# Altium schematic sheet PA-CONTROL.SchDoc
size A3; SheetNumber: 5; SheetTotal: 5
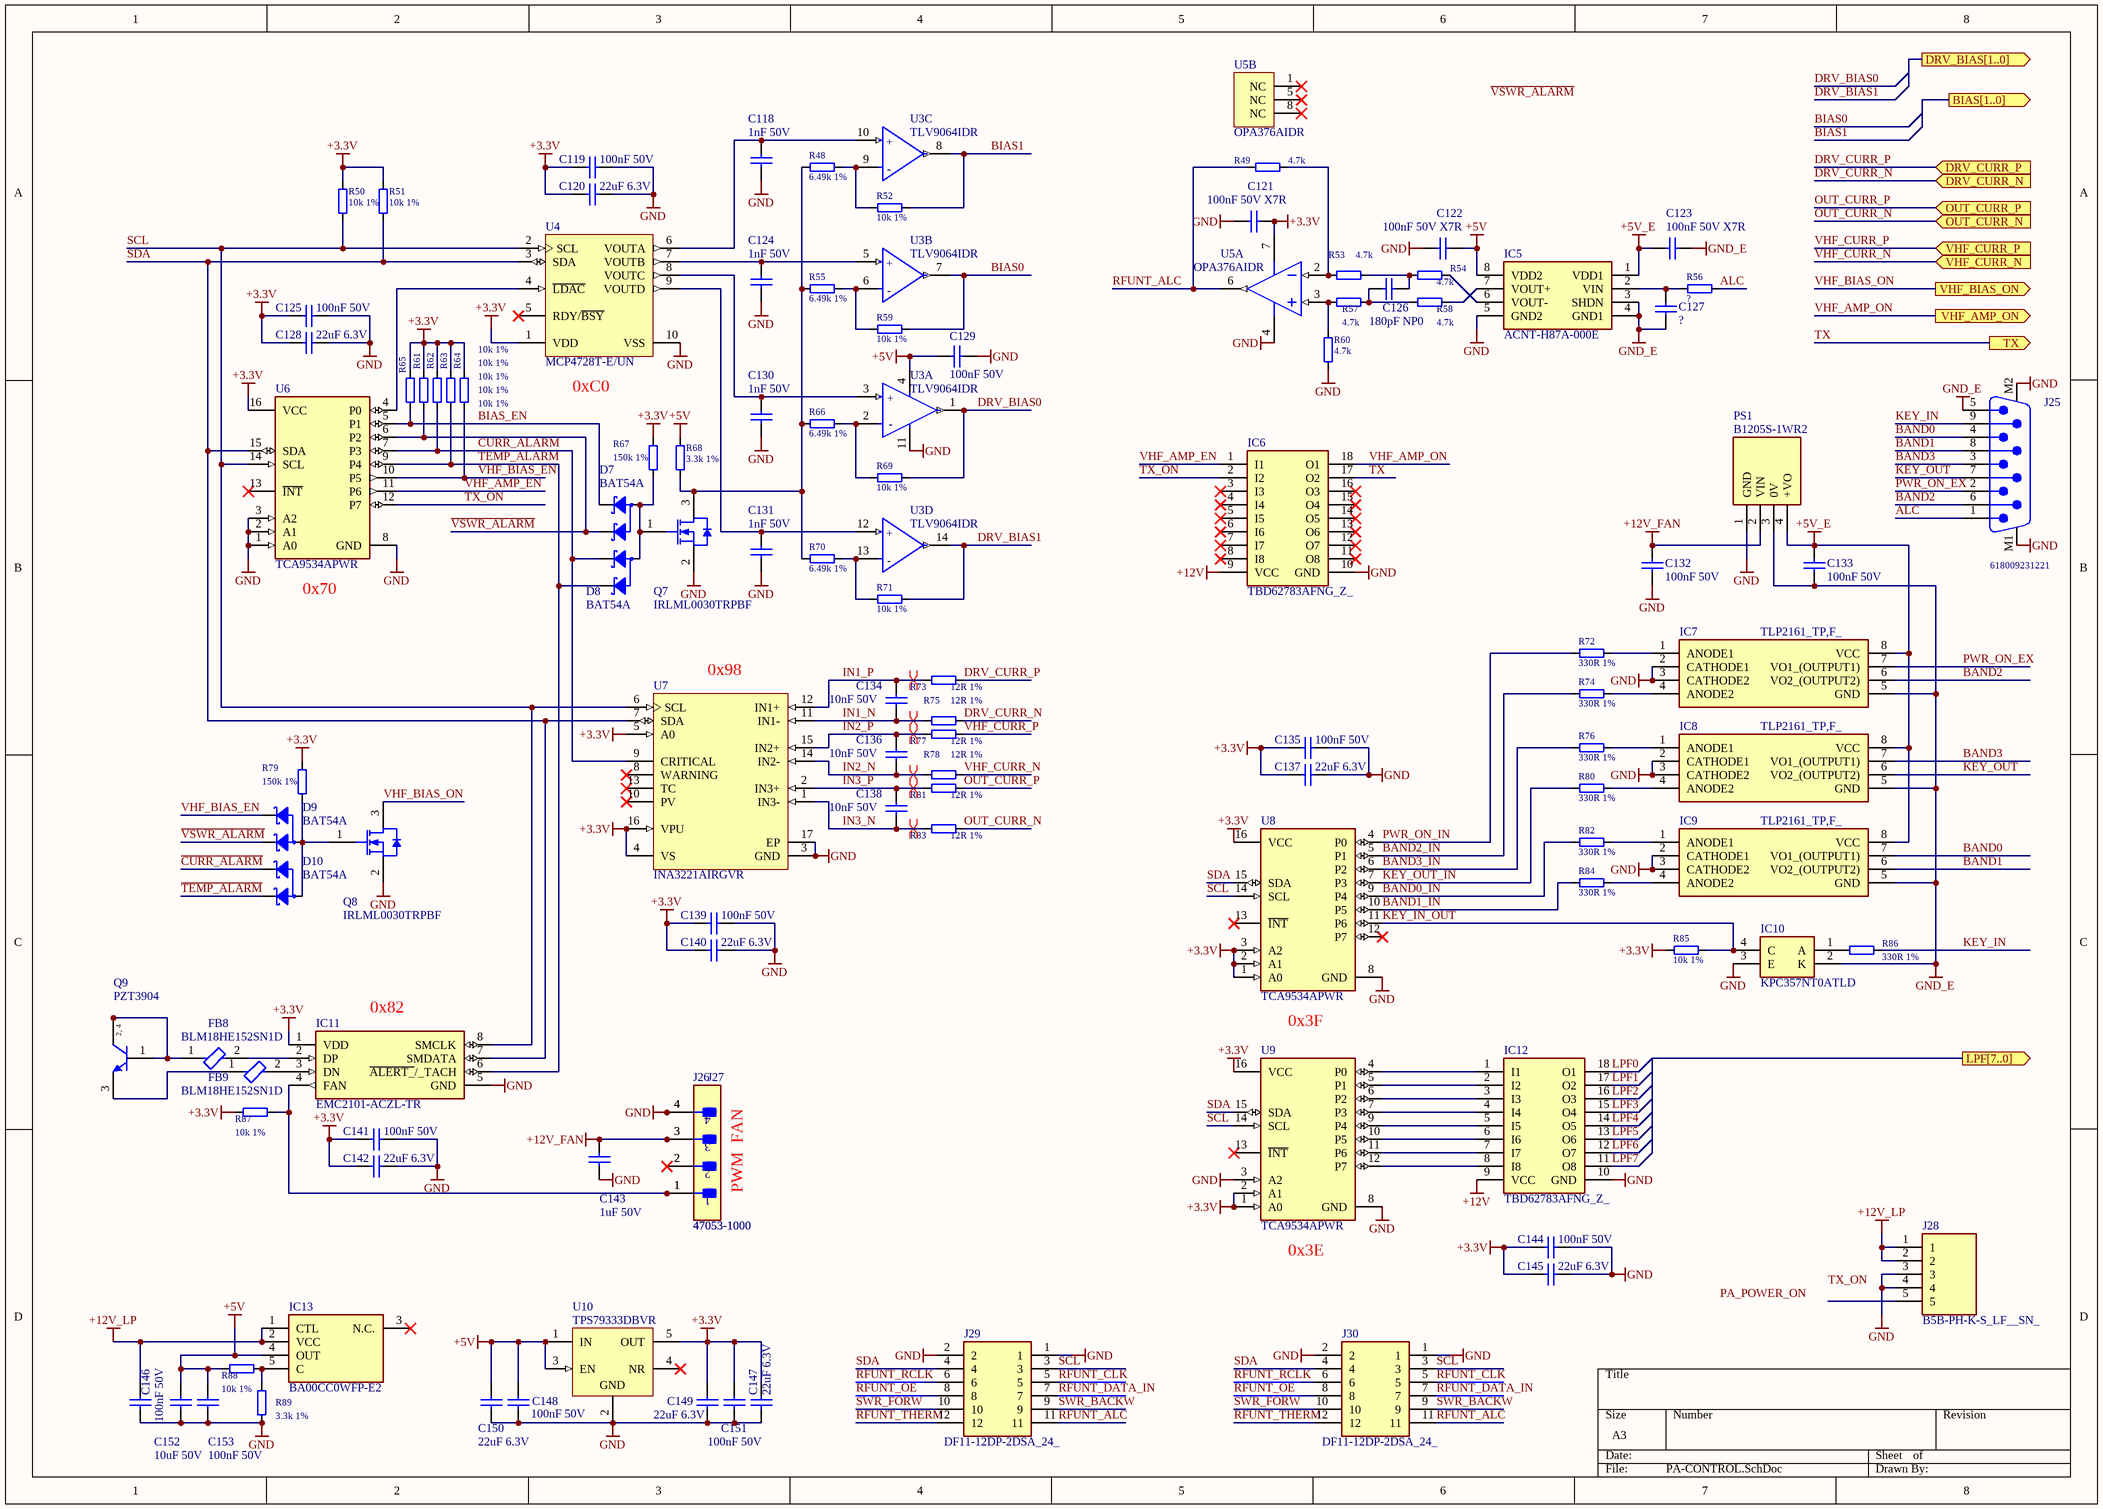
[diagram p0: PA-CONTROL.SchDoc]

## Parts
C118  1nF 50V  [C-0805]
C119  100nF 50V  [C-0805]
C120  22uF 6.3V  [C-0805]
C121  100nF 50V X7R  [C-0805]
C122  100nF 50V X7R  [C-0805]
C123  100nF 50V X7R  [C-0805]
C124  1nF 50V  [C-0805]
C125  100nF 50V  [C-0805]
C126  180pF NP0  [C-0805]
C127  ?  [C-0805]
C128  22uF 6.3V  [C-0805]
C129  100nF 50V  [C-0805]
C130  1nF 50V  [C-0805]
C131  1nF 50V  [C-0805]
C132  100nF 50V  [C-0805]
C133  100nF 50V  [C-0805]
C134  10nF 50V  [C-0805]
C135  100nF 50V  [C-0805]
C136  10nF 50V  [C-0805]
C137  22uF 6.3V  [C-0805]
C138  10nF 50V  [C-0805]
C139  100nF 50V  [C-0805]
C140  22uF 6.3V  [C-0805]
C141  100nF 50V  [C-0805]
C142  22uF 6.3V  [C-0805]
C143  1uF 50V  [C-0805]
C144  100nF 50V  [C-0805]
C145  22uF 6.3V  [C-0805]
C146  100nF 50V  [C-0805]
C147  22uF 6.3V  [C-0805]
C148  100nF 50V  [C-0805]
C149  22uF 6.3V  [C-0805]
C150  22uF 6.3V  [C-0805]
C151  100nF 50V  [C-0805]
C152  10uF 50V  [C-0805]
C153  100nF 50V  [C-0805]
D7  BAT54A  [SOT-23]
D8  BAT54A  [SOT-23]
D9  BAT54A  [SOT-23]
D10  BAT54A  [SOT-23]
FB8  BLM18HE152SN1D  [FP-BLM18-0_15-t0_8-IPC_C]
FB9  BLM18HE152SN1D  [FP-BLM18-0_15-t0_8-IPC_C]
IC5  ACNT-H87A-000E  [SOIC127P1661X403-8N]
IC6  TBD62783AFNG_Z_  [SOP65P640X155-18N]
IC7  TLP2161_TP,F_  [SOIC127P600X290-8N]
IC8  TLP2161_TP,F_  [SOIC127P600X290-8N]
IC9  TLP2161_TP,F_  [SOIC127P600X290-8N]
IC10  KPC357NT0ATLD  [KPC357NT0ATLD]
IC11  EMC2101-ACZL-TR  [SOP65P490X110-8N]
IC12  TBD62783AFNG_Z_  [SOP65P640X155-18N]
IC13  BA00CC0WFP-E2  [BA00CC0WFPE2]
J25  618009231221  [618009231221]
J26  47053-1000  [FP-47053-1000-MFG]
J27  47053-1000  [FP-47053-1000-MFG]
J28  B5B-PH-K-S_LF__SN_  [SHDR5W50P0X200_1X5_1190X450X600P]
J29  DF11-12DP-2DSA_24_  [SHDR12W60P200_2X6_1400X500X690P]
J30  DF11-12DP-2DSA_24_  [SHDR12W60P200_2X6_1400X500X690P]
PS1  B1205S-1WR2  [B1205S1WR2]
Q7  IRLML0030TRPBF  [INTR-SOT-23-3_V]
Q8  IRLML0030TRPBF  [INTR-SOT-23-3_V]
Q9  PZT3904  [FAIR-SOT223-4_V]
R48  6.49k 1%  [R-0805]
R49  4.7k  [R-0805]
R50  10k 1%  [R-0805]
R51  10k 1%  [R-0805]
R52  10k 1%  [R-0805]
R53  4.7k  [R-0805]
R54  4.7k  [R-0805]
R55  6.49k 1%  [R-0805]
R56  ?  [R-0805]
R57  4.7k  [R-0805]
R58  4.7k  [R-0805]
R59  10k 1%  [R-0805]
R60  4.7k  [R-0805]
R61  10k 1%  [R-0805]
R62  10k 1%  [R-0805]
R63  10k 1%  [R-0805]
R64  10k 1%  [R-0805]
R65  10k 1%  [R-0805]
R66  6.49k 1%  [R-0805]
R67  150k 1%  [R-0805]
R68  3.3k 1%  [R-0805]
R69  10k 1%  [R-0805]
R70  6.49k 1%  [R-0805]
R71  10k 1%  [R-0805]
R72  330R 1%  [R-0805]
R73  12R 1%  [R-0805]
R74  330R 1%  [R-0805]
R75  12R 1%  [R-0805]
R76  330R 1%  [R-0805]
R77  12R 1%  [R-0805]
R78  12R 1%  [R-0805]
R79  150k 1%  [R-0805]
R80  330R 1%  [R-0805]
R81  12R 1%  [R-0805]
R82  330R 1%  [R-0805]
R83  12R 1%  [R-0805]
R84  330R 1%  [R-0805]
R85  10k 1%  [R-0805]
R86  330R 1%  [R-0805]
R87  10k 1%  [R-0805]
R88  10k 1%  [R-0805]
R89  3.3k 1%  [R-0805]
U3  TLV9064IDR  [FP-D0014A-MFG]  (parts A,B,C,D of 4)
U4  MCP4728T-E/UN  [MSOP-UN10_L]
U5  OPA376AIDR  [D0008A_N]  (parts A,B of 2)
U6  TCA9534APWR  [FP-PW0016A-MFG]
U7  INA3221AIRGVR  [RGV0016A_V]
U8  TCA9534APWR  [FP-PW0016A-MFG]
U9  TCA9534APWR  [FP-PW0016A-MFG]
U10  TPS79333DBVR  [DBV0005A_L]

## Ports
BIAS[1..0] (out), DRV_BIAS[1..0] (out), DRV_CURR_N (in), DRV_CURR_P (in), LPF[7..0] (out), OUT_CURR_N (in), OUT_CURR_P (in), TX (out), VHF_AMP_ON (out), VHF_BIAS_ON (out), VHF_CURR_N (in), VHF_CURR_P (in)

## Nets
+3.3V: C119.2 C120.2 C121.2 C125.2 C128.2 C135.2 C137.2 C139.2 C140.2 C141.2 C142.2 C144.2 C145.2 C147.2 C149.2 C151.2 IC11.1(VDD) R50.1 R51.1 R61.1 R62.1 R63.1 R64.1 R65.1 R67.1 R79.1 R85.2 R87.2 U4.1(VDD) U5.7(V+) U6.16(VCC) U7.4(VS) U7.5(A0) U7.16(VPU) U8.1(A0) U8.2(A1) U8.3(A2) U8.16(VCC) U9.1(A0) U9.2(A1) U9.16(VCC) U10.5(OUT)
+5V: C122.2 C129.2 C148.2 C150.2 C152.2 C153.2 IC5.8(VDD2) IC13.4(OUT) R68.1 R88.2 U3.4(V+) U10.1(IN) U10.3(EN)
+5V_E: C123.1 C133.1 IC5.1(VDD1) IC7.8(VCC) IC8.8(VCC) IC9.8(VCC) PS1.4(+VO)
+12V: IC6.9(VCC) IC12.9(VCC)
+12V_FAN: C132.1 C143.2 J26.3 J27.3 PS1.2(VIN)
+12V_LP: C146.2 IC13.1(CTL) IC13.2(VCC) J28.1 J28.2
GND: C118.1 C119.1 C120.1 C121.1 C122.1 C124.1 C125.1 C128.1 C129.1 C130.1 C131.1 C132.2 C135.1 C137.1 C139.1 C140.1 C141.1 C142.1 C143.1 C144.1 C145.1 C146.1 C147.1 C148.1 C149.1 C150.1 C151.1 C152.1 C153.1 IC5.5(GND2) IC6.10(GND) IC7.2(CATHODE1) IC7.3(CATHODE2) IC8.2(CATHODE1) IC8.3(CATHODE2) IC9.2(CATHODE1) IC9.3(CATHODE2) IC10.3(E) IC11.5(GND) IC12.10(GND) J25.M1 J25.M2 J26.4 J27.4 J28.3 J28.4 J29.1 J29.2 J30.1 J30.2 PS1.1(GND) Q7.2(S) Q8.2(S) R60.2 R89.2 U3.11(V-) U4.10(VSS) U5.4(V-) U6.1(A0) U6.2(A1) U6.3(A2) U6.8(GND) U7.3(GND) U7.17(EP) U8.8(GND) U9.3(A2) U9.8(GND) U10.2(GND)
GND_E: C123.2 C127.2 C133.2 IC5.3(SHDN) IC5.4(GND1) IC7.5(GND) IC8.5(GND) IC9.5(GND) IC10.2(K) J25.5 PS1.3(0V)
ALC: J25.1 R56.1
BAND0: IC9.7(VO1_(OUTPUT1)) J25.4
BAND0_IN: R82.2 U8.9(P4)
BAND1: IC9.6(VO2_(OUTPUT2)) J25.8
BAND1_IN: R84.2 U8.10(P5)
BAND2: IC7.6(VO2_(OUTPUT2)) J25.6
BAND2_IN: R74.2 U8.5(P1)
BAND3: IC8.7(VO1_(OUTPUT1)) J25.3
BAND3_IN: R76.2 U8.6(P2)
BIAS0: R59.1 U3.7(OUT2)
BIAS1: R52.1 U3.8(OUT3)
BIAS_EN: D7.1 R65.2 U6.5(P1)
~{CURR_ALARM}: D8.1 D10.2 R62.2 U6.7(P3) U7.9(CRITICAL)
DRV_BIAS0: R69.1 U3.1(OUT1)
DRV_BIAS1: R71.1 U3.14(OUT4)
DRV_CURR_N: R75.1 ; port DRV_CURR_N
DRV_CURR_P: R73.1 ; port DRV_CURR_P
IN1_N: C134.1 R75.2 U7.11(IN1-)
IN1_P: C134.2 R73.2 U7.12(IN1+)
IN2_N: C136.1 R78.2 U7.14(IN2-)
IN2_P: C136.2 R77.2 U7.15(IN2+)
IN3_N: C138.1 R83.2 U7.1(IN3-)
IN3_P: C138.2 R81.2 U7.2(IN3+)
KEY_IN: J25.9 R86.1
KEY_IN_OUT: IC10.4(C) R85.1 U8.11(P6)
KEY_OUT: IC8.6(VO2_(OUTPUT2)) J25.7
KEY_OUT_IN: R80.2 U8.7(P3)
LPF0: IC12.18(O1)
LPF1: IC12.17(O2)
LPF2: IC12.16(O3)
LPF3: IC12.15(O4)
LPF4: IC12.14(O5)
LPF5: IC12.13(O6)
LPF6: IC12.12(O7)
LPF7: IC12.11(O8)
OUT_CURR_N: R83.1 ; port OUT_CURR_N
OUT_CURR_P: R81.1 ; port OUT_CURR_P
PWR_ON_EX: IC7.7(VO1_(OUTPUT1)) J25.2
PWR_ON_IN: R72.2 U8.4(P0)
RFUNT_ALC: J29.11 J30.11 R49.2 U5.6(OUT)
RFUNT_CLK: J29.5 J30.5
RFUNT_DATA_IN: J29.7 J30.7
RFUNT_OE: J29.8 J30.8
RFUNT_RCLK: J29.6 J30.6
RFUNT_THERM: J29.12 J30.12
SCL: IC11.8(SMCLK) J29.3 J30.3 R50.2 U4.2(SCL) U6.14(SCL) U7.6(SCL) U8.14(SCL) U9.14(SCL)
SDA: IC11.7(SMDATA) J29.4 J30.4 R51.2 U4.3(SDA) U6.15(SDA) U7.7(SDA) U8.15(SDA) U9.15(SDA)
SWR_BACKW: J29.9 J30.9
SWR_FORW: J29.10 J30.10
~{TEMP_ALARM}: D8.2 D10.1 IC11.6(~{ALERT_}/_TACH) R63.2 U6.9(P4)
TX: IC6.17(O2) ; port TX
TX_ON: IC6.2(I2) U6.12(P7)
~{VSWR_ALARM}: D7.2 D9.1 R61.2 U6.6(P2)
VHF_AMP_EN: IC6.1(I1) U6.11(P6)
VHF_AMP_ON: IC6.18(O1) ; port VHF_AMP_ON
VHF_BIAS_EN: D9.2 R64.2 U6.10(P5)
VHF_BIAS_ON: Q8.3(D) ; port VHF_BIAS_ON
VHF_CURR_N: R78.1 ; port VHF_CURR_N
VHF_CURR_P: R77.1 ; port VHF_CURR_P
NetC118_2: C118.2 U3.10(IN3+) U4.6(VOUTA)
NetC124_2: C124.2 U3.5(IN2+) U4.7(VOUTB)
NetC126_1: C126.1 R57.1 R58.2
NetC126_2: C126.2 R53.1 R54.2
NetC127_1: C127.1 IC5.2(VIN) R56.2
NetC130_2: C130.2 U3.3(IN1+) U4.8(VOUTC)
NetC131_2: C131.2 U3.12(IN4+) U4.9(VOUTD)
NetD7_3: D7.3 D8.3 Q7.1(G) R67.2
NetD9_3: D9.3 D10.3 Q8.1(G) R79.2
NetFB8_1: FB8.1 Q9.1(B) Q9.2(C) Q9.4(C)
NetFB8_2: FB8.2 IC11.2(DP)
NetFB9_1: FB9.1 Q9.3(E)
NetFB9_2: FB9.2 IC11.3(DN)
NetIC5_6: IC5.6(VOUT-) R54.1
NetIC5_7: IC5.7(VOUT+) R58.1
NetIC7_1: IC7.1(ANODE1) R72.1
NetIC7_4: IC7.4(ANODE2) R74.1
NetIC8_1: IC8.1(ANODE1) R76.1
NetIC8_4: IC8.4(ANODE2) R80.1
NetIC9_1: IC9.1(ANODE1) R82.1
NetIC9_4: IC9.4(ANODE2) R84.1
NetIC10_1: IC10.1(A) R86.2
NetIC11_4: IC11.4(FAN) J26.1 J27.1 R87.1
NetIC12_1: IC12.1(I1) U9.4(P0)
NetIC12_2: IC12.2(I2) U9.5(P1)
NetIC12_3: IC12.3(I3) U9.6(P2)
NetIC12_4: IC12.4(I4) U9.7(P3)
NetIC12_5: IC12.5(I5) U9.9(P4)
NetIC12_6: IC12.6(I6) U9.10(P5)
NetIC12_7: IC12.7(I7) U9.11(P6)
NetIC12_8: IC12.8(I8) U9.12(P7)
NetIC13_5: IC13.5(C) R88.1 R89.1
NetJ26_2: J26.2 J27.2
NetQ7_3: Q7.3(D) R48.2 R55.2 R66.2 R68.2 R70.2
NetR48_1: R48.1 R52.2 U3.9(IN3-)
NetR49_1: R49.1 R53.2 U5.2(IN-)
NetR55_1: R55.1 R59.2 U3.6(IN2-)
NetR57_2: R57.2 R60.1 U5.3(IN+)
NetR66_1: R66.1 R69.2 U3.2(IN1-)
NetR70_1: R70.1 R71.2 U3.13(IN4-)
NetU4_4: U4.4(~{LDAC}) U6.4(P0)

Not connected (* = marked no-connect by the designer): IC6 3(I3)* 4(I4)* 5(I5)* 6(I6)* 7(I7)* 8(I8)* 11(O8)* 12(O7)* 13(O6)* 14(O5)* 15(O4)* 16(O3)*; IC13 3(N.C.)*; J28 5; U4 5(RDY/~{BSY})*; U5 1(NC)* 5(NC)* 8(NC)*; U6 13(~{INT})*; U7 8(WARNING)* 10(PV)* 13(TC)*; U8 12(P7)* 13(~{INT})*; U9 13(~{INT})*; U10 4(NR)*

## Layout directives
differential pair: IN1_N, IN1_P, IN2_N, IN2_P, IN3_N, IN3_P

## Notes on the sheet
- (near U4) 0xC0
- (near U6) 0x70
- (near U7) 0x98
- (near IC11) 0x82
- 0x3F
- PWM  FAN
- (near U9) 0x3E
- Labels drawn without touching a wire or pin: PA_POWER_ON, TX_ON, ~{VSWR_ALARM}
- (in symbol CMP-2000-06916-1) 2, 4
- (in symbol CMP-04895-000189-1, part A) +; -
- (in symbol CMP-04895-000189-1, part B) +; -
- (in symbol CMP-04895-000189-1, part C) +; -
- (in symbol CMP-04895-000189-1, part D) +; -

## Library data of the parts
C118-C153 = C semi: Ceramic Multilayer Capacitor
FB8 FB9 = CMP-0686-00368-3: Chip Ferrite Bead, 0603, 1500Ω @ 100MHz, 0.5Ω, 25%, 500mA; Impedance: 1.5kR; DC Resistance (DCR): 500mR; Number of Circuits: 1; Test Frequency: 100MHz; Case/Package: 0603; Max Operating Temperature: 125°C; Package Quantity: 1; Max DC Current: 500mA; Tolerance: 25%; Core Material: Ferrite; Width: 0.8mm; Number of Pins: 2; Depth: 0.8mm; Radiation Hardening: No; Case Code (Imperial): 0603; Min Operating Temperature: -55°C; Termination: SMD/SMT; Material: Ferrite; Military Standard: Not; Number of Lines: 1; DC Current: 500mA; Length: 1.6mm; REACH SVHC: No SVHC; Lead Free: Lead Free; Current Rating: 500mA; Max Current Rating: 500mA; Packaging: Tape and Reel; Case Code (Metric): 1608; Height: 0.8mm
IC5 = ACNT-H87A-000E: Integrated Circuit; Manufacturer_Name: Avago Technologies; Datasheet Link: https://4donline.ihs.com/images/VipMasterIC/IC/AVGO/AVGO-S-A0003550281/AVGO-S-A0003550281-1.pdf?hkey=52A5661711E402568146F3353EA87419; Height: 4.034mm; Manufacturer_Part_Number: ACNT-H87A-000E; Mouser Part Number: 630-ACNT-H87A-000E; Mouser Price/Stock: https://www.mouser.co.uk/ProductDetail/Broadcom-Avago/ACNT-H87A-000E?qs=BZBei1rCqCBJ1okFPm4nfQ%3D%3D
IC6 IC12 = TBD62783AFNG_Z_: Integrated Circuit; Manufacturer_Name: Toshiba; Manufacturer_Part_Number: TBD62783AFNG(Z); Datasheet Link: https://toshiba.semicon-storage.com/info/docget.jsp?did=30523; Height: 1.55mm
IC7-IC9 = TLP2160_TP,F_: Integrated Circuit; Manufacturer_Name: Toshiba; Manufacturer_Part_Number: TLP2160(TP,F); Datasheet Link: https://toshiba.semicon-storage.com/info/docget.jsp?did=10044&prodName=TLP2160; Height: 2.9mm; Mouser Part Number: 757-TLP2160TPF; Mouser Price/Stock: https://www.mouser.co.uk/ProductDetail/Toshiba/TLP2160TPF?qs=BybUIy1AcUYH5UC919f%2FeA%3D%3D; Arrow Part Number: TLP2160(TP,F); Arrow Price/Stock: https://www.arrow.com/en/products/tlp2160-tpf/toshiba
IC10 = KPC357NT0ATLD: Integrated Circuit; Manufacturer_Name: Cosmo Electronics; Datasheet Link: https://datasheet.lcsc.com/szlcsc/Cosmo-Electronics-KPC357NT0ATLD_C136410.pdf; Height: 2.7mm; Manufacturer_Part_Number: KPC357NT0ATLD
IC11 = EMC2101-ACZL-TR: Integrated Circuit; Manufacturer_Name: Microchip; Datasheet Link: http://ww1.microchip.com/downloads/en/DeviceDoc/2101.pdf; Height: 1.1mm; Manufacturer_Part_Number: EMC2101-ACZL-TR; Mouser Part Number: 886-EMC2101-ACZL-TR; Mouser Price/Stock: https://www.mouser.co.uk/ProductDetail/Microchip-Technology/EMC2101-ACZL-TR?qs=pA5MXup5wxFIE%2FN8LSbs9g%3D%3D; Arrow Part Number: EMC2101-ACZL-TR; Arrow Price/Stock: https://www.arrow.com/en/products/emc2101-aczl-tr/microchip-technology
IC13 = BA00CC0WFP-E2: Integrated Circuit; Manufacturer_Name: ROHM Semiconductor; Datasheet Link: https://datasheet.datasheetarchive.com/originals/dk/DKDS-10/186347.pdf; Height: 2.5mm; Manufacturer_Part_Number: BA00CC0WFP-E2; Mouser Part Number: 755-BA00CC0WFP-E2; Mouser Price/Stock: https://www.mouser.co.uk/ProductDetail/ROHM-Semiconductor/BA00CC0WFP-E2?qs=4kLU8WoGk0t%2Fg3HZY45H1w%3D%3D; Arrow Part Number: BA00CC0WFP-E2; Arrow Price/Stock: https://www.arrow.com/en/products/ba00cc0wfp-e2/rohm-semiconductor
J25 = CMP-1502-00284-1: Male PCB Connector with Hex Screw WR-DSUB, 8.08 mm, Angled, 9 pins; Manufacturer: Wurth Elektronik; Working Voltage: 125VAC; Contact Resistance: 30mOhm; Rated Current: 3A; Pin Number: 9; Manufacturer URL: http://www.we-online.de; Orientation: Angled; Operating Temperature: -40to85degC; Package Reference: 618009231221; Gender: Male; Mounting Technology: THT; Publisher: WurthElektronik; Datasheet URL: https://katalog.we-online.de/em/datasheet/6180xx231221.pdf; Part Number: 618009231221; Packaging: Tray
J26 J27 = CMP-04776-000290-1: CONN HEADER VERT 4POS 2.54MM; Number of Positions: 4; Voltage Rating (DC): 250V; Gender: Male; Current Rating: 4A; Glow Wire Compliant: Non-compliant; Contact Material: Brass; Contact Plating: Tin; Radiation Hardening: No; Package Quantity: 12000; Packaging: Bulk; Termination: Through Hole; Depth: 5.84mm; Series: 47053; Number of Contacts: 4; Length: 10.2mm; Halogen Free: Low Halogen; Number of Circuits: 4; Max Operating Temperature: 75°C; Housing Color: Beige; Min Operating Temperature: 0°C; Number of Rows: 1; Pitch: 2.54mm; Housing Material: Nylon; Orientation: Vertical; Mount: Through Hole; Voltage Rating: 250V
J28 = B5B-PH-K-S_LF__SN_: Connector; Manufacturer_Name: JST (JAPAN SOLDERLESS TERMINALS); Manufacturer_Part_Number: B5B-PH-K-S(LF)(SN); Datasheet Link: http://uk.rs-online.com/web/p/products/8201438; Height: 6mm; Arrow Part Number: B5B-PH-K-S(LF)(SN); Arrow Price/Stock: https://www.arrow.com/en/products/b5b-ph-k-s-lf-sn/jst-manufacturing
J29 J30 = DF11-12DP-2DSA_24_: Connector; Manufacturer_Name: Hirose; Manufacturer_Part_Number: DF11-12DP-2DSA(24); Datasheet Link: https://datasheet.datasheetarchive.com/originals/distributors/SFDatasheet-7/sf-000141225.pdf; Height: 6.9mm; Mouser Part Number: 798-DF11-12DP-2DSA24; Mouser Price/Stock: https://www.mouser.co.uk/ProductDetail/Hirose-Connector/DF11-12DP-2DSA24?qs=zOgoZG1CgI9hGIQfeQgy6Q%3D%3D; Arrow Part Number: DF11-12DP-2DSA(24); Arrow Price/Stock: https://www.arrow.com/en/products/df11-12dp-2dsa-24/hirose-electric
PS1 = B1205S-1WR2: Power Supply; Manufacturer_Name: Mornsun; Datasheet Link: https://www.mornsun-power.com/public/uploads/pdf/B_D-1WR2.pdf; Height: 10.41mm; Manufacturer_Part_Number: B1205S-1WR2
Q7 Q8 = CMP-2000-06483-1: HEXFET(R) Power MOSFET, 1.3 W, 4.4 ns, -55 to 150 degC, 3-Pin SOT-23, RoHS, Tape and Reel; Manufacturer: International Rectifier; Maximum Drain Source Resistance: 0.027Ω; Transistor Configuration: Single; Channel Mode: Enhancement; Maximum Power Dissipation: 1.3W; Typical Input Capacitance @ Vds: 382pF@15V; Maximum Gate Source Voltage: ±20V; Number of Elements per Chip: 1; Transistor Material: Si; Maximum Gate Threshold Voltage: 2.3V; Typical Turn-On Delay Time: 5.2ns; Maximum Drain Source Voltage: 30V; Typical Turn-Off Delay Time: 7.4ns; Minimum Gate Threshold Voltage: 1.3V; Channel Type: N; Typical Gate Charge @ Vgs: 2.6nC@4.5V; Maximum Continuous Drain Current: 5.3A; Pin Count: 3; Mounting Technology: SurfaceMount; Datasheet URL: https://datasheet.ciiva.com/4442/irlml0030pbf-90019-4442451.pdf; Datasheet Version: 02/2012; Maximum Operating Temperature: +150°C; Category: PowerMOSFET; Package Description: 3-Pin Small Outline Transistor, Body 2.92 x 1.3 mm, Pitch 0.95 mm; Manufacturer URL: http://internationalrectifier.com/; Height: 1.02mm; Minimum Operating Temperature: -55°C; Dimensions: 3.04x1.4x1.02mm; Package Reference: SOT-23-3; Package Type: SOT-23; Mounting Type: SurfaceMount; Length: 3.04mm; Width: 1.4mm
Q9 = CMP-2000-06916-1: NPN General-Purpose Amplifier, 40 V, 200 mA, -55 to 150 degC, 4-Pin SOT223, RoHS, Tape and Reel; Manufacturer: FairchildSemiconductor; Maximum Collector Emitter Saturation Voltage: 0.2@1mA@10mA; Package Version: Rev. 3, 07/2016; Rad Hard: No; Minimum DC Current Gain: 40@0.1mA@1V; Maximum DC Collector Current: 0.2A; Maximum Collector Base Voltage: 60V; Maximum Operating Frequency: 300(Min)MHz; Maximum Power Dissipation: 1000mW; Maximum Collector Emitter Voltage: 40V; Manufacturer URL: https://www.fairchildsemi.com/; Package URL: https://www.fairchildsemi.com.cn/package-drawings/MA/MA04A.pdf; Mounting Technology: SurfaceMount; Mounting: SurfaceMount; Datasheet URL: https://www.fairchildsemi.com/datasheets/MM/MMBT3904.pdf; Operating Temperature: -55to150°C; Package Description: 4-Pin Small Outline Transistor, Body 6.45 x 3.5 mm, Pitch 2.3 mm; Datasheet Version: Rev. 1.1.0, 10/2014; Packaging: Tape&Reel; Package Reference: SOT223-4; Package: 4SOT-223; Category: GPBJT; Type: NPN; Pin Count: 4
R48-R89 = RES semi: Chip Resistor; Power: *; TCR: *; Series: *; Tolerance: *
U3 = CMP-04895-000189-1: IC CMOS 4 CIRCUIT 14SOIC; Output Current per Channel: 50mA; Number of Circuits: 4; Gain Bandwidth Product: 10MHz; Input Bias Current: 0.5pA; Slew Rate: 6.5V/µs; Operating Supply Current: 538uA; Input Offset Voltage (Vos): 300uV; Min Operating Temperature: -40°C; RoHS Compliant: Yes; Max Operating Temperature: 125°C; Mount: Surface Mount; Number of Pins: 14; Packaging: Cut Tape; Case/Package: SOIC; Number of Channels: 4
U4 = CMP-0188-01009-2: 12-Bit Quad Digital-to-Analog Converter with EEPROM Memory, 10-pin MSOP, Extended Temperature, Tape and Reel; ComponentLink3Description: Package Specification; ComponentLink3URL: http://www.microchip.com/stellent/groups/techpub_sg/documents/packagingspec/en012702.pdf; RevisionNote: URLs added. DatasheetVersion updated.; DatasheetVersion: revE, Oct-2010; ComponentLink2URL: http://ww1.microchip.com/downloads/en/DeviceDoc/22187E.pdf; ComponentLink2Description: Datasheet; PackageDescription: 10-Lead Plastic Micro Small Outline Package (UN) [MSOP]; PackageVersion: revBB, Aug-2009; ComponentLink1Description: Manufacturer URL; ComponentLink1URL: http://www.microchip.com/; PackageReference: MSOP-UN10
U5 = CMP-0272-00694-3: Precision, Low Noise, Low Iq Operational Amplifier, 2.2 to 5.5 V, -40 to 125 degC, 8-pin SOIC (D8), Green (RoHS & no Sb/Br); Manufacturer: Texas Instruments; Vio (25C)(Max)(mV): 0.025; Number of Channels: 1; Sub Family: Low Input Bias Current Amp (<=10pA), Low Noise Amp (<=10nV/rtHz), Low Offset Voltage Amplifier (<=500uV), Low Supply Voltage Amplifier (<=2.7V), Precision Amplifier; Offset Drift(Typ)(uV/C): 0.32; Total Supply Voltage(Max)(+5V is 5, +/-5V is 10): 5.5; Vn at 1kHz(Typ)(nV/rtHz): 7.5; IIB(Max)(pA): 10; CMRR(Min)(dB): 76; Iq per channel(Max)(mA): 0.95; Total Supply Voltage(Min)(+5V is 5, +/-5V is 10): 2.2; Slew Rate(Typ)(V/us): 2; ComponentLink3URL: http://www.ti.com/litv/pdf/msoi002j; ComponentLink3Description: Package Specification; ComponentLink1Description: Manufacturer URL; Eco-Plan: Green (RoHS & no Sb/Br); DatasheetVersion: SBOS406F; PackageVersion: 4040047-3/M, 06/2011; ComponentLink1URL: http://www.ti.com/; PackageDescription: 8-Pin Plastic Small Outline, Body 4.9 x 3.9 mm, Pitch 1.27 mm; ComponentLink2Description: Datasheet; PackageReference: D0008A; PartNumber: OPA376AIDR; Mounting Technology: Surface Mount; ComponentLink2URL: http://www.ti.com/general/docs/lit/getliterature.tsp?genericPartNumber=OPA376&fileType=pdf; Code_JEDEC: MS-012
U6 U8 U9 = CMP-04886-000001-1: IC I/O EXPANDER I2C 8B 16TSSOP; Manufacturer: Texas Instruments; Max Junction Temp: 100°C; Interface: I2C,SMBus; Standoff Height: 0.05mm; Nominal Supply Current: 5-22uA; Number Of I/Os: 8; Max Supply Voltage: 5.5V; Min Supply Voltage: 1.65V; Frequency: 400kHz; Device Class L3: I/O Expanders; Octopart: https://octopart.com/tca9534apwr-texas+instruments-50333529; ComponentLink2URL: http://www.ti.com/lit/ds/symlink/tca9534a.pdf; ComponentLink2Description: Datasheet; Ambient Temperature Range Low: -40°C; Manufacturer Part Number: TCA9534APWR; Lead Free: Yes; Category: IC; Package: PW0016A; Automotive: No; Temperature Range Low: -40°C; Temperature Range High: +85°C; Device Class L2: Interface ICs; Temperature: -40°C to +85°C; RoHS: TRUE; Height: 1.2mm; Digikey Description: IC I/O EXPANDER I2C 8B 16TSSOP; Device Class L1: Integrated Circuits (ICs); Ambient Temperature Range High: +85°C
U7 = CMP-0704-00001-2: Triple Channel Shunt and Bus Voltage Monitor, 120 dB, 2.7 to 5.5 V, -40 to 125 degC, 16-Pin VQFN (RGV), Green (RoHS & no Sb/Br), Tape and Reel; Manufacturer: Texas Instruments; Rating: Catalog; Quiescent Current (Typ): 350 uA; Gain Error (max): 0.25%; CMR (Typ): 120 dB; Offset Voltage (max): +/- 80 uV; Gain: 1 V/V; Voltage Input Range (Bus): 0 to 26 V; ComponentLink2Description: Datasheet; PackageDescription: 16-Pin Quad Flat No-lead Package, Body 4 x 4 mm, Pitch 0.65 mm; ComponentLink3URL: http://www.ti.com/lit/ds/symlink/ina3221.pdf; PartNumber: INA3221AIRGVR; Operating Supply Range: 2.7 to 5.5 V; DatasheetVersion: SBOS576A; Temperature Range: -40 to 125 degC; ComponentLink1Description: Manufacturer URL; ComponentLink1URL: http://www.ti.com/; RoHS: TRUE; ComponentLink3Description: Package Specification; Packing: Tape and Reel; Mounting Technology: Surface Mount; ComponentLink2URL: http://www.ti.com/lit/ds/symlink/ina3221.pdf; PackageVersion: SBOS576A; PackageReference: RGV0016A
U10 = CMP-0394-00364-2: Single Output High PSRR LDO, 200 mA, Fixed 3.3 V Output, 2.7 to 5.5 V Input, 5-pin SOT-23 (DBV), -40 to 85 degC, Green (RoHS & no Sb/Br); Manufacturer: Texas Instruments; Iout(Max)(A): 0.2; Rating: Catalog; Vin(Min)(V): 2.7; Vdo(Typ)(mV): 102; Fixed Output Options(V): 3.3; Accuracy(%): 2; SubFamily: Single Channel LDO; Vin(Max)(V): 5.5; ComponentLink1URL: http://www.ti.com/; ComponentLink2URL: http://www.ti.com/general/docs/lit/getliterature.tsp?genericPartNumber=TPS79333&fileType=pdf; ComponentLink1Description: Manufacturer URL; PackageDescription: 5-Pin Plastic Small Outline, Body 1.60 Ãƒâ€” 2.90 mm, Pitch 0.95 mm; ComponentLink3URL: http://www.ti.com/litv/pdf/mpds018i; ComponentLink2Description: Datasheet; Mounting Technology: Surface Mount; ComponentLink3Description: Package Specification; PackageReference: DBV0005A; Code_JEDEC: MO-178; PartNumber: TPS79333DBVR; Vout Adj(Min)(V): 3.3; DatasheetVersion: SLVS348K; Eco-Plan: Green (RoHS & no Sb/Br); PackageVersion: 4073253-4/K; Vout Adj(Max)(V): 3.3; Iq(Typ)(mA): 0.2